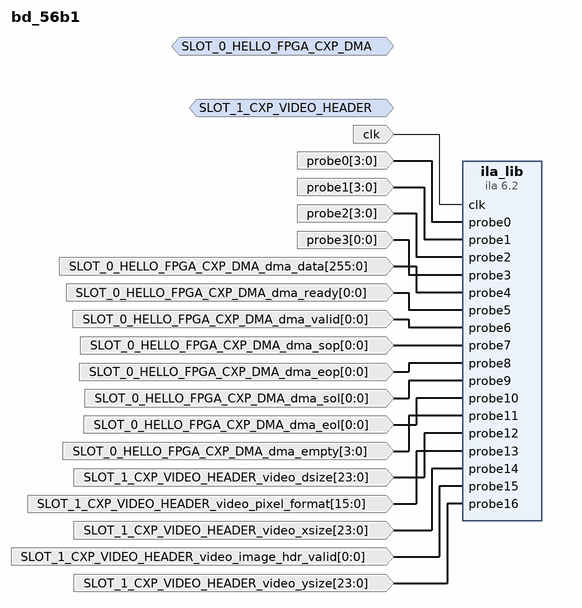
[diagram p0: block diagram of the top level]
# Vivado block design bd_56b1, xcku060-ffva1156-2-i, Vivado 2019.1
create_bd_design bd_56b1

create_bd_intf_port -mode Monitor -vlnv visn.intranet:user:hello_fpga_cxp_dma_rtl:1.0 SLOT_0_HELLO_FPGA_CXP_DMA
create_bd_intf_port -mode Monitor -vlnv Hello_FPGA:CXP:cxp_video_header_rtl:1.0 SLOT_1_CXP_VIDEO_HEADER
create_bd_port -dir I -type clk clk
create_bd_port -dir I -from 3 -to 0 probe0
create_bd_port -dir I -from 3 -to 0 probe1
create_bd_port -dir I -from 3 -to 0 probe2
create_bd_port -dir I -from 0 -to 0 probe3
create_bd_port -dir I -from 255 -to 0 SLOT_0_HELLO_FPGA_CXP_DMA_dma_data
create_bd_port -dir I -from 0 -to 0 SLOT_0_HELLO_FPGA_CXP_DMA_dma_ready
create_bd_port -dir I -from 0 -to 0 SLOT_0_HELLO_FPGA_CXP_DMA_dma_valid
create_bd_port -dir I -from 0 -to 0 SLOT_0_HELLO_FPGA_CXP_DMA_dma_sop
create_bd_port -dir I -from 0 -to 0 SLOT_0_HELLO_FPGA_CXP_DMA_dma_eop
create_bd_port -dir I -from 0 -to 0 SLOT_0_HELLO_FPGA_CXP_DMA_dma_sol
create_bd_port -dir I -from 0 -to 0 SLOT_0_HELLO_FPGA_CXP_DMA_dma_eol
create_bd_port -dir I -from 3 -to 0 SLOT_0_HELLO_FPGA_CXP_DMA_dma_empty
create_bd_port -dir I -from 23 -to 0 SLOT_1_CXP_VIDEO_HEADER_video_dsize
create_bd_port -dir I -from 15 -to 0 SLOT_1_CXP_VIDEO_HEADER_video_pixel_format
create_bd_port -dir I -from 23 -to 0 SLOT_1_CXP_VIDEO_HEADER_video_xsize
create_bd_port -dir I -from 0 -to 0 SLOT_1_CXP_VIDEO_HEADER_video_image_hdr_valid
create_bd_port -dir I -from 23 -to 0 SLOT_1_CXP_VIDEO_HEADER_video_ysize

create_bd_cell -type ip -vlnv xilinx.com:ip:ila:6.2 ila_lib
set_property -dict [list \
  CONFIG.ALL_PROBE_SAME_MU TRUE \
  CONFIG.ALL_PROBE_SAME_MU_CNT 1 \
  CONFIG.C_ADV_TRIGGER FALSE \
  CONFIG.C_DATA_DEPTH 1024 \
  CONFIG.C_EN_STRG_QUAL 0 \
  CONFIG.C_EN_TIME_TAG 0 \
  CONFIG.C_ILA_CLK_FREQ 250000000 \
  CONFIG.C_INPUT_PIPE_STAGES 0 \
  CONFIG.C_MONITOR_TYPE Native \
  CONFIG.C_NUM_OF_PROBES 17 \
  CONFIG.C_PROBE0_MU_CNT 1 \
  CONFIG.C_PROBE0_TYPE 0 \
  CONFIG.C_PROBE0_WIDTH 4 \
  CONFIG.C_PROBE10_TYPE 0 \
  CONFIG.C_PROBE10_WIDTH 1 \
  CONFIG.C_PROBE11_TYPE 0 \
  CONFIG.C_PROBE11_WIDTH 4 \
  CONFIG.C_PROBE12_TYPE 0 \
  CONFIG.C_PROBE12_WIDTH 24 \
  CONFIG.C_PROBE13_TYPE 0 \
  CONFIG.C_PROBE13_WIDTH 16 \
  CONFIG.C_PROBE14_TYPE 0 \
  CONFIG.C_PROBE14_WIDTH 24 \
  CONFIG.C_PROBE15_TYPE 0 \
  CONFIG.C_PROBE15_WIDTH 1 \
  CONFIG.C_PROBE16_TYPE 0 \
  CONFIG.C_PROBE16_WIDTH 24 \
  CONFIG.C_PROBE1_MU_CNT 1 \
  CONFIG.C_PROBE1_TYPE 0 \
  CONFIG.C_PROBE1_WIDTH 4 \
  CONFIG.C_PROBE2_MU_CNT 1 \
  CONFIG.C_PROBE2_TYPE 0 \
  CONFIG.C_PROBE2_WIDTH 4 \
  CONFIG.C_PROBE3_MU_CNT 1 \
  CONFIG.C_PROBE3_TYPE 0 \
  CONFIG.C_PROBE3_WIDTH 1 \
  CONFIG.C_PROBE4_TYPE 0 \
  CONFIG.C_PROBE4_WIDTH 256 \
  CONFIG.C_PROBE5_TYPE 0 \
  CONFIG.C_PROBE5_WIDTH 1 \
  CONFIG.C_PROBE6_TYPE 0 \
  CONFIG.C_PROBE6_WIDTH 1 \
  CONFIG.C_PROBE7_TYPE 0 \
  CONFIG.C_PROBE7_WIDTH 1 \
  CONFIG.C_PROBE8_TYPE 0 \
  CONFIG.C_PROBE8_WIDTH 1 \
  CONFIG.C_PROBE9_TYPE 0 \
  CONFIG.C_PROBE9_WIDTH 1 \
  CONFIG.C_TIME_TAG_WIDTH 32 \
  CONFIG.C_TRIGIN_EN false \
  CONFIG.C_TRIGOUT_EN false \
  CONFIG.C_XLNX_HW_PROBE_INFO DEFAULT \
] [get_bd_cells ila_lib]

# ---- connections ----

connect_bd_net [get_bd_ports clk] [get_bd_pins ila_lib/clk]
connect_bd_net -net probe0_1 [get_bd_ports probe0] [get_bd_pins ila_lib/probe0]
connect_bd_net -net probe1_1 [get_bd_ports probe1] [get_bd_pins ila_lib/probe1]
connect_bd_net -net probe2_1 [get_bd_ports probe2] [get_bd_pins ila_lib/probe2]
connect_bd_net -net probe3_1 [get_bd_ports probe3] [get_bd_pins ila_lib/probe3]
connect_bd_net [get_bd_ports SLOT_0_HELLO_FPGA_CXP_DMA_dma_data] [get_bd_pins ila_lib/probe4]
connect_bd_net [get_bd_ports SLOT_0_HELLO_FPGA_CXP_DMA_dma_ready] [get_bd_pins ila_lib/probe5]
connect_bd_net [get_bd_ports SLOT_0_HELLO_FPGA_CXP_DMA_dma_valid] [get_bd_pins ila_lib/probe6]
connect_bd_net [get_bd_ports SLOT_0_HELLO_FPGA_CXP_DMA_dma_sop] [get_bd_pins ila_lib/probe7]
connect_bd_net [get_bd_ports SLOT_0_HELLO_FPGA_CXP_DMA_dma_eop] [get_bd_pins ila_lib/probe8]
connect_bd_net [get_bd_ports SLOT_0_HELLO_FPGA_CXP_DMA_dma_sol] [get_bd_pins ila_lib/probe9]
connect_bd_net [get_bd_ports SLOT_0_HELLO_FPGA_CXP_DMA_dma_eol] [get_bd_pins ila_lib/probe10]
connect_bd_net [get_bd_ports SLOT_0_HELLO_FPGA_CXP_DMA_dma_empty] [get_bd_pins ila_lib/probe11]
connect_bd_net [get_bd_ports SLOT_1_CXP_VIDEO_HEADER_video_dsize] [get_bd_pins ila_lib/probe12]
connect_bd_net [get_bd_ports SLOT_1_CXP_VIDEO_HEADER_video_pixel_format] [get_bd_pins ila_lib/probe13]
connect_bd_net [get_bd_ports SLOT_1_CXP_VIDEO_HEADER_video_xsize] [get_bd_pins ila_lib/probe14]
connect_bd_net [get_bd_ports SLOT_1_CXP_VIDEO_HEADER_video_image_hdr_valid] [get_bd_pins ila_lib/probe15]
connect_bd_net [get_bd_ports SLOT_1_CXP_VIDEO_HEADER_video_ysize] [get_bd_pins ila_lib/probe16]

validate_bd_design
save_bd_design
